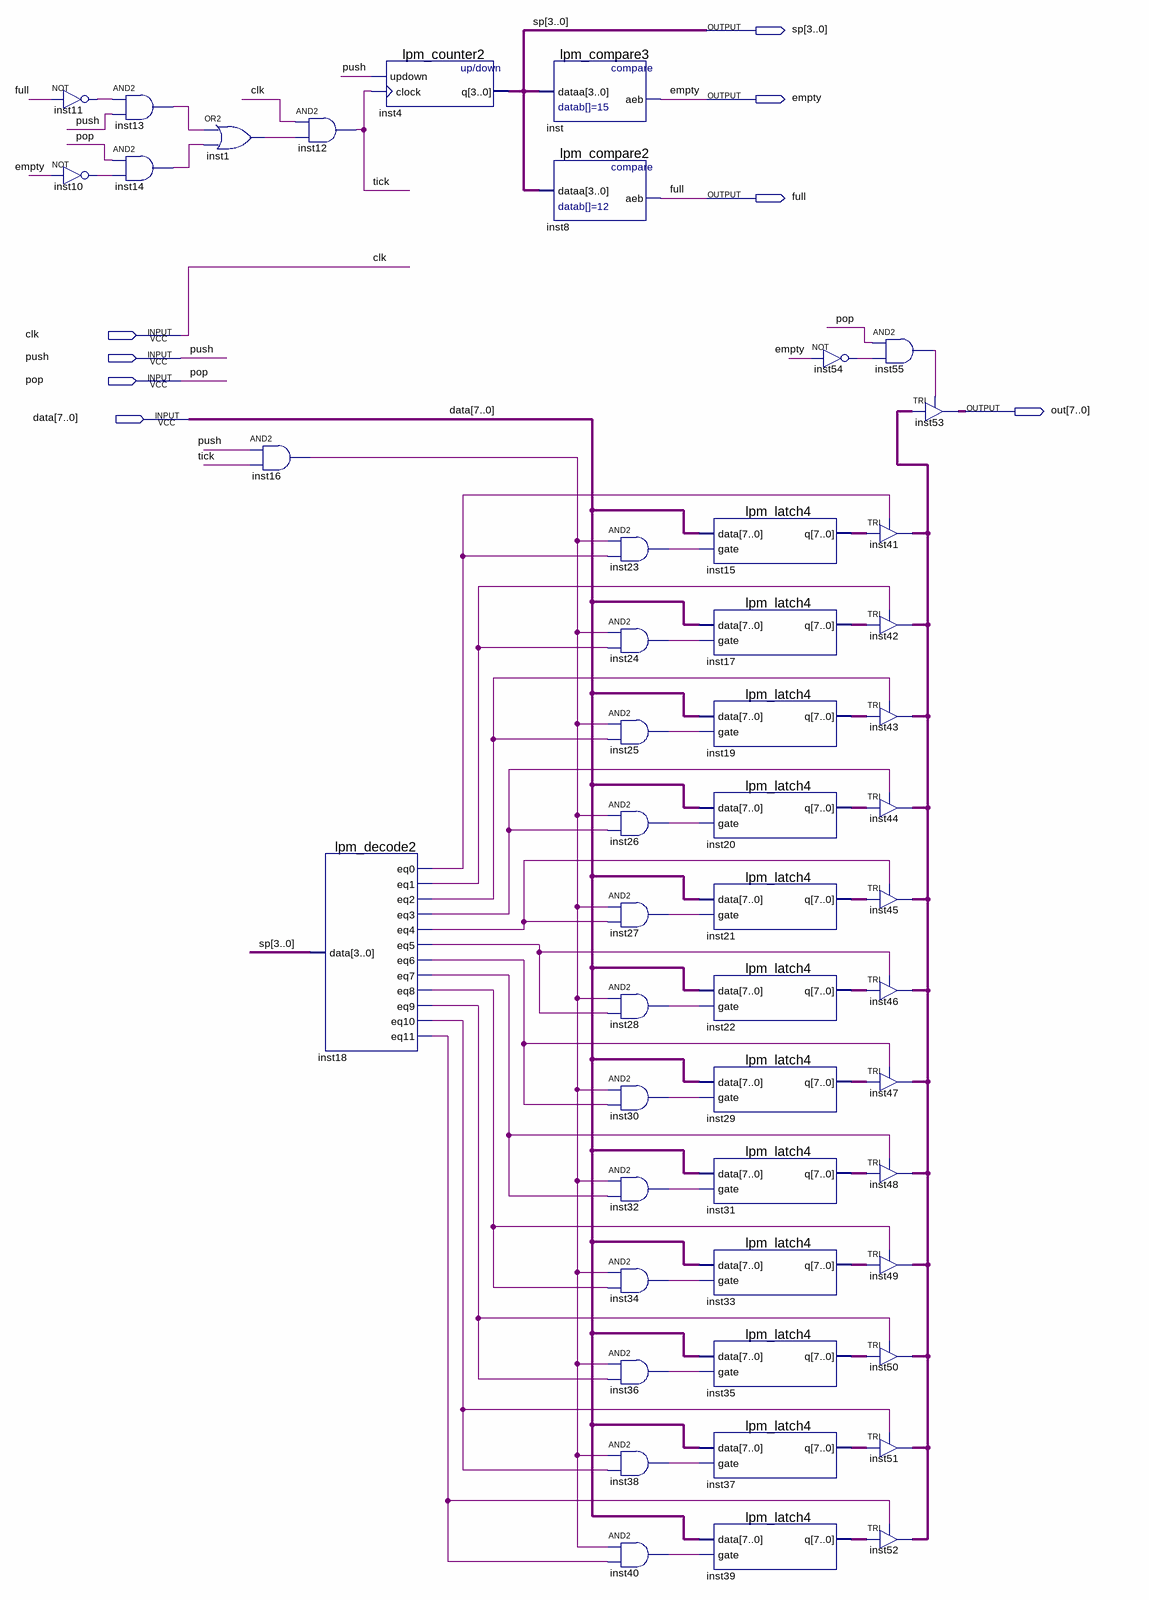
[diagram p0: schematic sheet]
// Quartus schematic STACK.bdf as structural Verilog: 50 symbols, 8 pins
module STACK (
  input  clk,
  input  push,
  input  pop,
  input  [7:0] data,
  output [3:0] sp,
  output empty,
  output full,
  output [7:0] out
);

  wire inst1_out, inst10_out, inst11_out, inst13_out, inst14_out, inst16_out, inst18_eq0, inst18_eq1,
       inst18_eq2, inst18_eq3, inst18_eq4, inst18_eq5, inst18_eq6, inst18_eq7, inst18_eq8, inst18_eq9,
       inst18_eq10, inst18_eq11, inst23_out, inst24_out, inst25_out, inst26_out, inst27_out, inst28_out,
       inst30_out, inst32_out, inst34_out, inst36_out, inst38_out, inst40_out, inst54_out, inst55_out, tick;
  wire [7:0] inst15_q, inst17_q, inst19_q, inst20_q, inst21_q, inst22_q, inst29_q, inst31_q, inst33_q,
       inst35_q, inst37_q, inst39_q, inst41_out;

  not inst11 (inst11_out, full);
  not inst10 (inst10_out, empty);
  and inst13 (inst13_out, inst11_out, push);
  and inst14 (inst14_out, pop, inst10_out);
  or inst1 (inst1_out, inst13_out, inst14_out);
  and inst12 (tick, clk, inst1_out);
  and inst16 (inst16_out, push, tick);
  lpm_decode2 inst18 (
    .data(sp), .eq0(inst18_eq0), .eq1(inst18_eq1), .eq2(inst18_eq2), .eq3(inst18_eq3), .eq4(inst18_eq4),
    .eq5(inst18_eq5), .eq6(inst18_eq6), .eq7(inst18_eq7), .eq8(inst18_eq8), .eq9(inst18_eq9),
    .eq10(inst18_eq10), .eq11(inst18_eq11));
  lpm_counter2 inst4 (.updown(push), .clock(tick), .q(sp));
  lpm_compare3 inst (.dataa(sp), .aeb(empty));
  lpm_compare2 inst8 (.dataa(sp), .aeb(full));
  and inst23 (inst23_out, inst16_out, inst18_eq0);
  and inst24 (inst24_out, inst16_out, inst18_eq1);
  and inst25 (inst25_out, inst16_out, inst18_eq2);
  and inst26 (inst26_out, inst16_out, inst18_eq3);
  and inst27 (inst27_out, inst16_out, inst18_eq4);
  and inst28 (inst28_out, inst16_out, inst18_eq5);
  and inst30 (inst30_out, inst16_out, inst18_eq6);
  and inst32 (inst32_out, inst16_out, inst18_eq7);
  and inst34 (inst34_out, inst16_out, inst18_eq8);
  and inst36 (inst36_out, inst16_out, inst18_eq9);
  and inst38 (inst38_out, inst16_out, inst18_eq10);
  and inst40 (inst40_out, inst16_out, inst18_eq11);
  lpm_latch4 inst15 (.data(data), .gate(inst23_out), .q(inst15_q));
  lpm_latch4 inst17 (.data(data), .gate(inst24_out), .q(inst17_q));
  lpm_latch4 inst19 (.data(data), .gate(inst25_out), .q(inst19_q));
  lpm_latch4 inst20 (.data(data), .gate(inst26_out), .q(inst20_q));
  lpm_latch4 inst21 (.data(data), .gate(inst27_out), .q(inst21_q));
  lpm_latch4 inst22 (.data(data), .gate(inst28_out), .q(inst22_q));
  lpm_latch4 inst29 (.data(data), .gate(inst30_out), .q(inst29_q));
  lpm_latch4 inst31 (.data(data), .gate(inst32_out), .q(inst31_q));
  lpm_latch4 inst33 (.data(data), .gate(inst34_out), .q(inst33_q));
  lpm_latch4 inst35 (.data(data), .gate(inst36_out), .q(inst35_q));
  lpm_latch4 inst37 (.data(data), .gate(inst38_out), .q(inst37_q));
  lpm_latch4 inst39 (.data(data), .gate(inst40_out), .q(inst39_q));
  not inst54 (inst54_out, empty);
  and inst55 (inst55_out, pop, inst54_out);
  TRI inst41[7:0] (.IN(inst15_q), .OE(inst18_eq0), .OUT(inst41_out));
  TRI inst42[7:0] (.IN(inst17_q), .OE(inst18_eq1), .OUT(inst41_out));
  TRI inst43[7:0] (.IN(inst19_q), .OE(inst18_eq2), .OUT(inst41_out));
  TRI inst44[7:0] (.IN(inst20_q), .OE(inst18_eq3), .OUT(inst41_out));
  TRI inst45[7:0] (.IN(inst21_q), .OE(inst18_eq4), .OUT(inst41_out));
  TRI inst46[7:0] (.IN(inst22_q), .OE(inst18_eq5), .OUT(inst41_out));
  TRI inst47[7:0] (.IN(inst29_q), .OE(inst18_eq6), .OUT(inst41_out));
  TRI inst48[7:0] (.IN(inst31_q), .OE(inst18_eq7), .OUT(inst41_out));
  TRI inst49[7:0] (.IN(inst33_q), .OE(inst18_eq8), .OUT(inst41_out));
  TRI inst50[7:0] (.IN(inst35_q), .OE(inst18_eq9), .OUT(inst41_out));
  TRI inst51[7:0] (.IN(inst37_q), .OE(inst18_eq10), .OUT(inst41_out));
  TRI inst52[7:0] (.IN(inst39_q), .OE(inst18_eq11), .OUT(inst41_out));
  TRI inst53[7:0] (.IN(inst41_out), .OE(inst55_out), .OUT(out));
endmodule
